# Altium schematic sheet UD3.1 Analog IO.SchDoc
size A4; DocumentNumber: 4; SheetNumber: 4; SheetTotal: 7
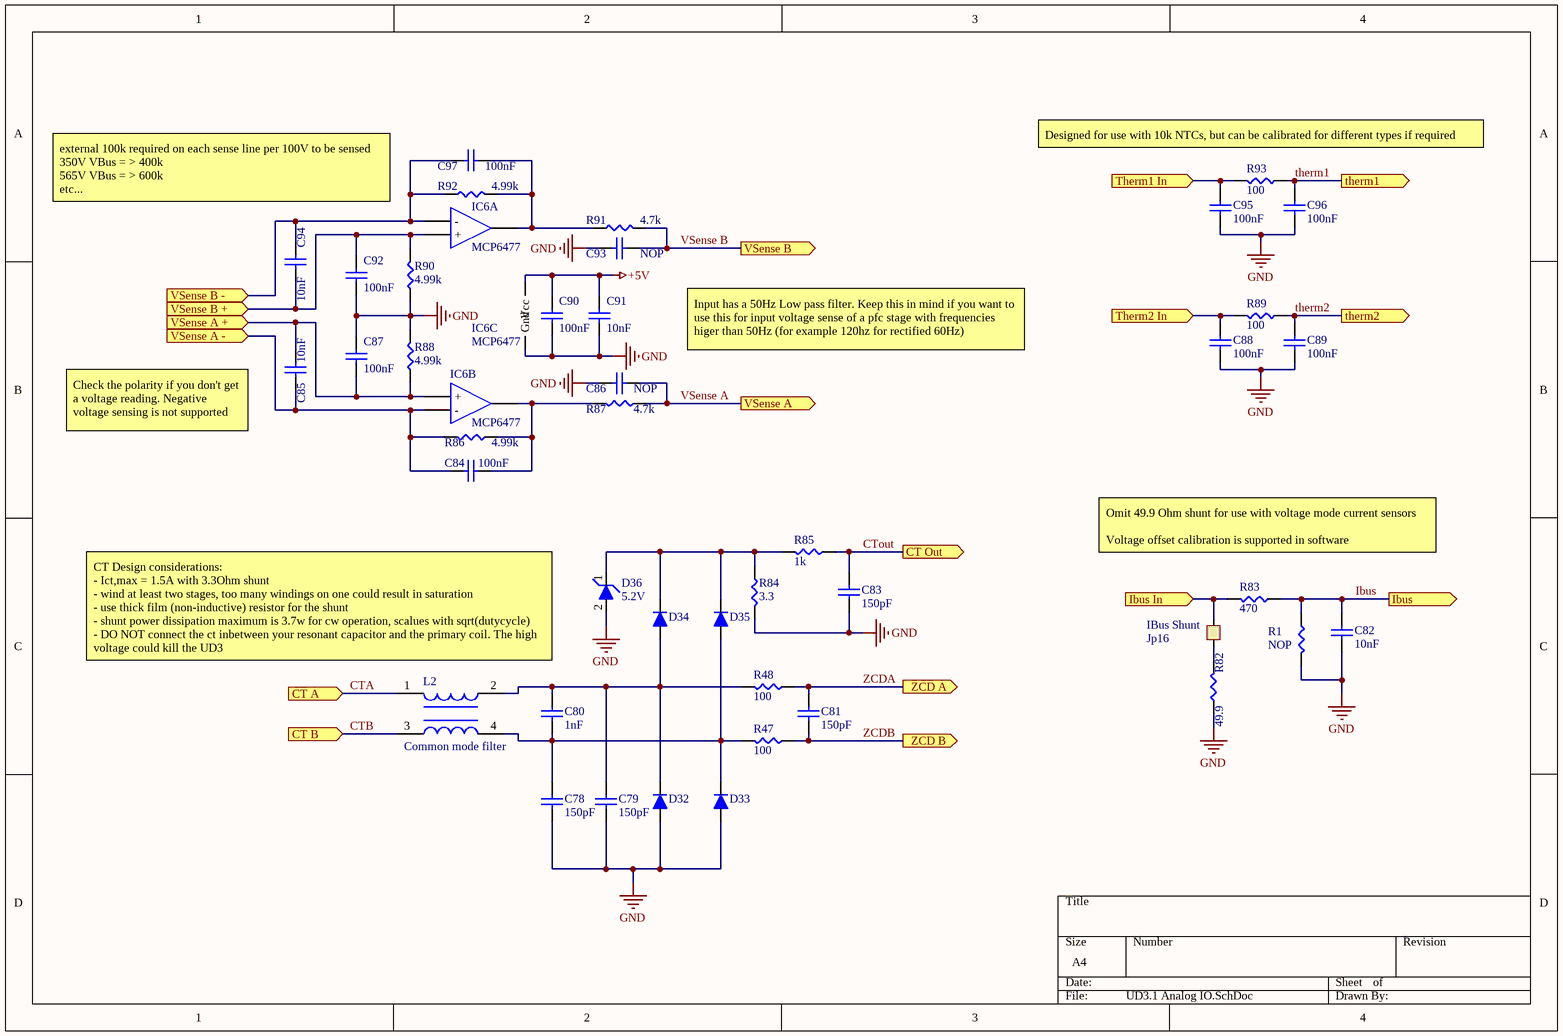
[diagram p0: UD3.1 Analog IO.SchDoc]

## Parts
C78  150pF  [0603]
C79  150pF  [0603]
C80  1nF  [0603]
C81  150pF  [0603]
C82  10nF  [0603]
C83  150pF  [0603]
C84  100nF  [0603]
C85  10nF  [0603]
C86  NOP  [0603]
C87  100nF  [0603]
C88  100nF  [0603]
C89  100nF  [0603]
C90  100nF  [0603]
C91  10nF  [0603]
C92  100nF  [0603]
C93  NOP  [0603]
C94  10nF  [0603]
C95  100nF  [0603]
C96  100nF  [0603]
C97  100nF  [0603]
D32  Schottky 30V 1A  [DO-214]  (value not drawn)
D33  Schottky 30V 1A  [DO-214]  (value not drawn)
D34  Schottky 30V 1A  [DO-214]  (value not drawn)
D35  Schottky 30V 1A  [DO-214]  (value not drawn)
D36  5.2V  [DO-214]
IC6  MCP6477  [soic8]  (parts A,B,C of 3)
Jp16  IBus Shunt  [PCB Jumper NO]
L2  Common mode filter  [SON127P600 4 POS (8.50mm x 5.60mm)]
R1  NOP  [0603]
R47  100  [0603]
R48  100  [0603]
R82  49.9  [1210]
R83  470  [0603]
R84  3.3  [0411 THT 2W]
R85  1k  [0603]
R86  4.99k  [0603]
R87  4.7k  [0603]
R88  4.99k  [0603]
R89  100  [0603]
R90  4.99k  [0603]
R91  4.7k  [0603]
R92  4.99k  [0603]
R93  100  [0603]

## Ports
CT A (in), CT B (in), CT Out (out), Ibus (out), Ibus In (in), therm1 (out), Therm1 In (in), therm2 (out), Therm2 In (in), VSense A (out), VSense A + (in), VSense A - (in), VSense B (out), VSense B + (in), VSense B - (in), ZCD A (out), ZCD B (out)

## Nets
+5V: C90.2 C91.2 IC6.8(Vcc)
GND: C78.2 C79.2 C82.1 C83.2 C86.1 C87.2 C88.1 C89.1 C90.1 C91.1 C92.1 C93.1 C95.1 C96.1 D32.1 D33.1 D36.2 IC6.4(Gnd) R1.2 R82.1 R84.2 R88.2 R90.1
CTA: L2.1 ; port CT A
CTB: L2.3 ; port CT B
CTout: C83.1 R85.1 ; port CT Out
Ibus: C82.2 R1.1 R83.1 ; port Ibus
Ibus In: Jp16.2 R83.2 ; port Ibus In
therm1: C96.2 R93.1 ; port therm1
Therm1 In: C95.2 R93.2 ; port Therm1 In
therm2: C89.2 R89.1 ; port therm2
Therm2 In: C88.2 R89.2 ; port Therm2 In
VSense A: C86.2 R87.2 ; port VSense A
VSense A +: C85.2 C87.1 IC6.5(+) R88.1 ; port VSense A +
VSense A -: C84.1 C85.1 IC6.6(-) R86.1 ; port VSense A -
VSense B: C93.2 R91.2 ; port VSense B
VSense B +: C92.2 C94.1 IC6.3(+) R90.2 ; port VSense B +
VSense B -: C94.2 C97.1 IC6.2(-) R92.1 ; port VSense B -
ZCDA: C81.1 R48.1 ; port ZCD A
ZCDB: C81.2 R47.1 ; port ZCD B
NetC78_1: C78.1 C80.2 D33.2 D35.1 L2.4 R47.2
NetC79_1: C79.1 C80.1 D32.2 D34.1 L2.2 R48.2
NetC84_2: C84.2 IC6.7(Q) R86.2 R87.1
NetC97_2: C97.2 IC6.1(Q) R91.1 R92.2
NetD34_2: D34.2 D35.2 D36.1 R84.1 R85.2
NetJp16_1: Jp16.1 R82.2

## Notes on the sheet
- Designed for use with 10k NTCs, but can be calibrated for different types if required
- external 100k required on each sense line per 100V to be sensed
  350V VBus = > 400k
  565V VBus = > 600k
  etc...
- Input has a 50Hz Low pass filter. Keep this in mind if you want to use this for input voltage sense of a pfc stage with frequencies higer than 50Hz (for example 120hz for rectified 60Hz)
- (near C85) Check the polarity if you don't get a voltage reading. Negative voltage sensing is not supported
- Omit 49.9 Ohm shunt for use with voltage mode current sensors
  Voltage offset calibration is supported in software
  Place 330Ω for R1 when using Current sensor with +/-15V output and watch out for the current direction
- CT Design considerations:
  - Ict,max = 1.5A with 3.3Ohm shunt
  - wind at least two stages, too many windings on one could result in saturation
  - use thick film (non-inductive) resistor for the shunt
  - shunt power dissipation maximum is 3.7w for cw operation, scalues with sqrt(dutycycle)
  - DO NOT connect the ct inbetween your resonant capacitor and the primary coil. The high voltage could kill the UD3

## Library data of the parts
C78-C97 = Cap
D32-D35 = Diode: Cmon its a diode what more do I need to say?; pin to pad: 1>2 2>1; Supplier 1: Digi-Key; Supplier Part Number 1: MBR10100GOS-ND; Supplier 2: Digi-Key; Supplier Part Number 2: 1655-1504-1-ND
D36 = TVS Diode: Supplier 1: Digi-Key; Supplier Part Number 1: UCLAMP3301HCT-ND
IC6 = OpAmp dual: Supplier 1: Digi-Key; Supplier Part Number 1: 296-27903-5-ND
Jp16 = Jumper
L2 = Common mode filter: pin to pad: 2>4 3>2 4>3; Supplier 1: Digi-Key; Supplier Part Number 1: 732-2358-1-ND
R1 R47 R48 R82-R93 = Resistor